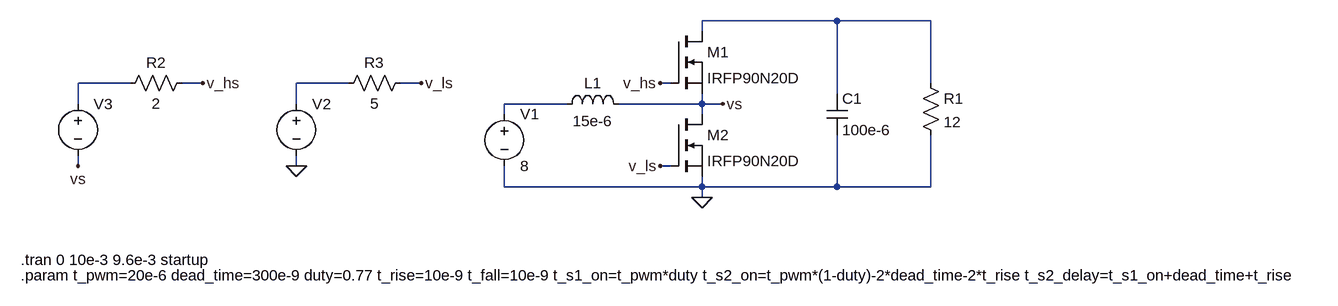
[diagram p0: schematic boost.asc]
boost.asc, the LTspice schematic file:
Version 4
SHEET 1 1668 680
WIRE 656 48 448 48
WIRE 800 48 656 48
WIRE 448 64 448 48
WIRE -432 144 -512 144
WIRE -320 144 -352 144
WIRE -96 144 -176 144
WIRE 16 144 -16 144
WIRE 400 144 384 144
WIRE 800 144 800 48
WIRE 656 160 656 48
WIRE -512 176 -512 144
WIRE -176 176 -176 144
WIRE 240 176 144 176
WIRE 448 176 448 160
WIRE 448 176 320 176
WIRE 480 176 448 176
WIRE 144 192 144 176
WIRE 448 192 448 176
WIRE -512 272 -512 256
WIRE -176 272 -176 256
WIRE 400 272 384 272
WIRE 144 304 144 272
WIRE 448 304 448 288
WIRE 448 304 144 304
WIRE 656 304 656 224
WIRE 656 304 448 304
WIRE 800 304 800 224
WIRE 800 304 656 304
WIRE 448 320 448 304
FLAG 480 176 vs
FLAG -320 144 v_hs
FLAG -512 272 vs
FLAG 384 144 v_hs
FLAG 448 320 0
FLAG -176 272 0
FLAG 16 144 v_ls
FLAG 384 272 v_ls
SYMBOL ind 224 192 R270
WINDOW 0 32 56 VTop 2
WINDOW 3 5 56 VBottom 2
SYMATTR InstName L1
SYMATTR Value 15e-6
SYMATTR SpiceLine Rser=7.5e-3
SYMBOL cap 640 160 R0
SYMATTR InstName C1
SYMATTR Value 100e-6
SYMATTR SpiceLine Rser=20e-3
SYMBOL res 784 128 R0
SYMATTR InstName R1
SYMATTR Value 12
SYMBOL voltage 144 176 R0
WINDOW 123 0 0 Left 0
WINDOW 39 0 0 Left 0
SYMATTR InstName V1
SYMATTR Value 8
SYMBOL res -336 128 R90
WINDOW 0 0 56 VBottom 2
WINDOW 3 32 56 VTop 2
SYMATTR InstName R2
SYMATTR Value 2
SYMBOL res 0 128 R90
WINDOW 0 0 56 VBottom 2
WINDOW 3 32 56 VTop 2
SYMATTR InstName R3
SYMATTR Value 5
SYMBOL nmos 400 192 R0
SYMATTR InstName M2
SYMATTR Value IRFP90N20D
SYMBOL nmos 400 64 R0
SYMATTR InstName M1
SYMATTR Value IRFP90N20D
SYMBOL voltage -176 160 R0
WINDOW 3 24 96 Invisible 2
WINDOW 123 0 0 Left 0
WINDOW 39 0 0 Left 0
SYMATTR Value PULSE(0 13 0 {t_rise} {t_fall} {t_s1_on} {t_pwm})
SYMATTR InstName V2
SYMBOL voltage -512 160 R0
WINDOW 3 24 96 Invisible 2
WINDOW 123 0 0 Left 0
WINDOW 39 0 0 Left 0
SYMATTR Value PULSE(0 13 {t_s2_delay} {t_rise} {t_fall} {t_s2_on} {t_pwm})
SYMATTR InstName V3
TEXT -600 416 Left 2 !.tran 0 10e-3 9.6e-3 startup
TEXT -600 440 Left 2 !.param t_pwm=20e-6 dead_time=300e-9 duty=0.77 t_rise=10e-9 t_fall=10e-9 t_s1_on=t_pwm*duty t_s2_on=t_pwm*(1-duty)-2*dead_time-2*t_rise t_s2_delay=t_s1_on+dead_time+t_rise

The netlist it stands for:
* boost.asc
L1 N004 vs 15e-6 Rser=7.5e-3
C1 N001 0 100e-6 Rser=20e-3
R1 N001 0 12
V1 N004 0 8
R2 v_hs N002 2
R3 v_ls N003 5
M2 vs v_ls 0 0 IRFP90N20D
M1 N001 v_hs vs vs IRFP90N20D
V2 N003 0 PULSE(0 13 0 {t_rise} {t_fall} {t_s1_on} {t_pwm})
V3 N002 vs PULSE(0 13 {t_s2_delay} {t_rise} {t_fall} {t_s2_on} {t_pwm})
.model NMOS NMOS
.model PMOS PMOS
.lib standard.mos
.tran 0 10e-3 9.6e-3 startup
.param t_pwm=20e-6 dead_time=300e-9 duty=0.77 t_rise=10e-9 t_fall=10e-9 t_s1_on=t_pwm*duty t_s2_on=t_pwm*(1-duty)-2*dead_time-2*t_rise t_s2_delay=t_s1_on+dead_time+t_rise
.backanno
.end